# Altium schematic sheet MAIN.SchDoc
size A3; SheetNumber: 1; SheetTotal: 1
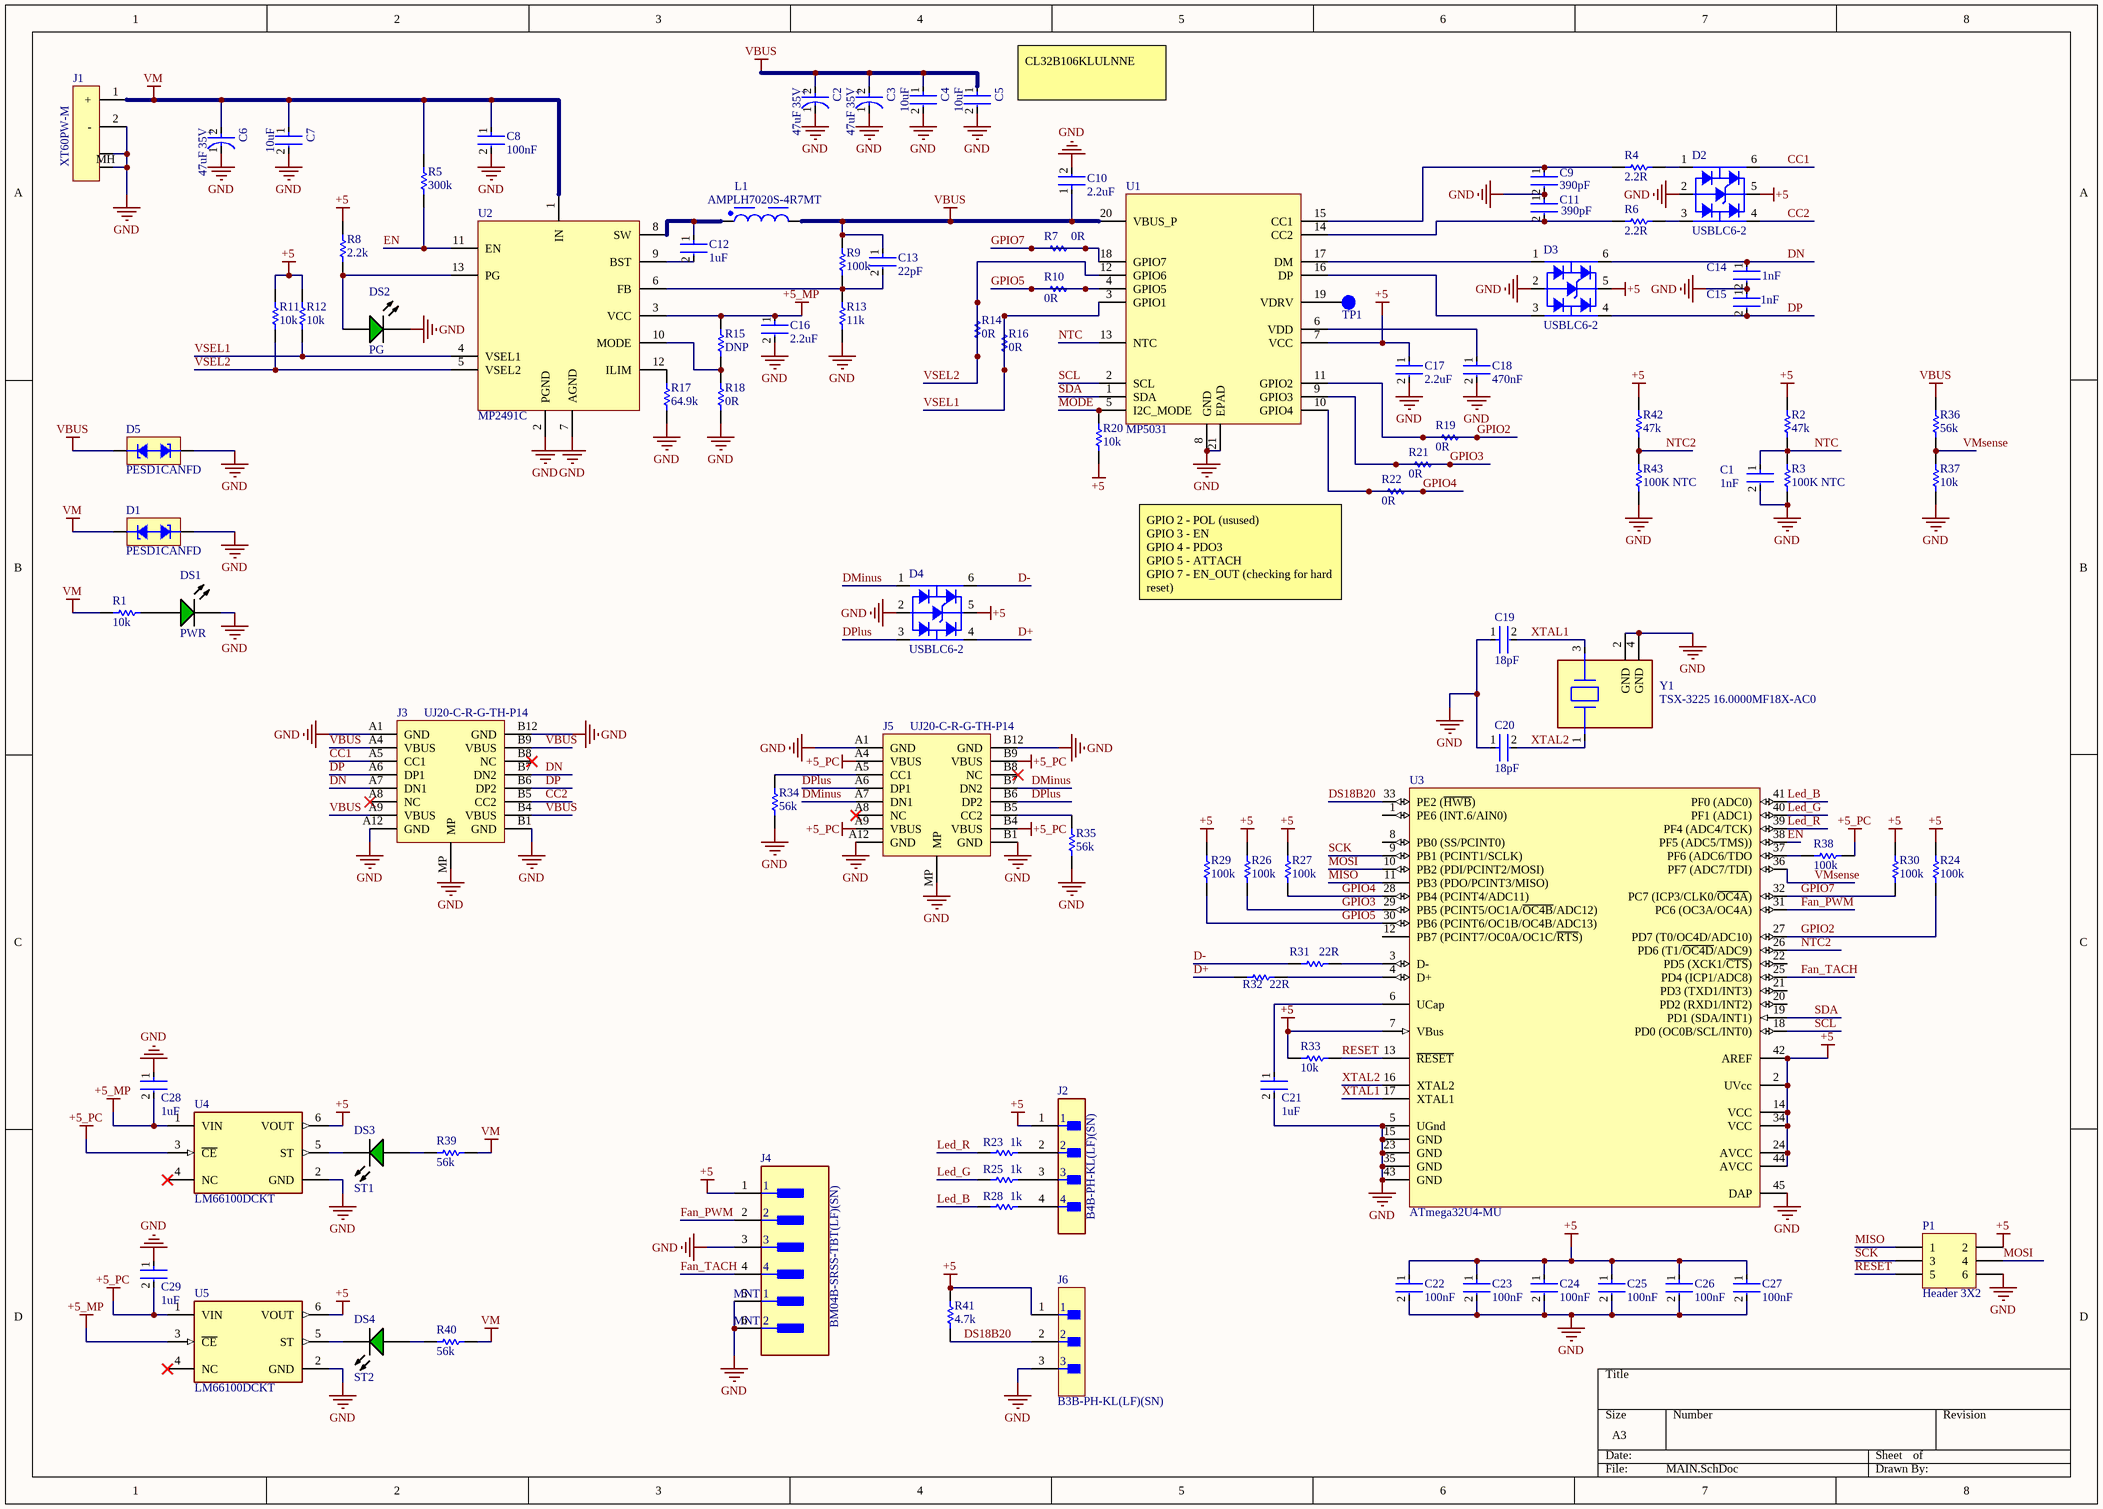
[diagram p0: MAIN.SchDoc]

## Parts
C1  1nF  [FP-0603-L_1_6_0_15-W_0_81-IPC_B]
C2  47uF 35V  [FP-T491X476K035AT-MFG]
C3  47uF 35V  [FP-T491X476K035AT-MFG]
C4  10uF  [FP-C1210C106M6PACTU-MFG]
C5  10uF  [FP-C1210C106M6PACTU-MFG]
C6  47uF 35V  [FP-T491X476K035AT-MFG]
C7  10uF  [FP-C1210C106M6PACTU-MFG]
C8  100nF  [FP-0603-L_1_6_0_1-W_0_8_0-IPC_C]
C9  390pF  [FP-C0603C-CF-IPC_B]
C10  2.2uF  [FP-GRM188-0_1-e0_2_0_5-IPC_B]
C11  390pF  [FP-C0603C-CF-IPC_B]
C12  1uF  [FP-0603-L_1_6_0_15-W_0_81-IPC_B]
C13  22pF  [FP-C0603C-CF-MFG]
C14  1nF  [FP-0603-L_1_6_0_15-W_0_81-IPC_B]
C15  1nF  [FP-0603-L_1_6_0_15-W_0_81-IPC_B]
C16  2.2uF  [FP-GRM188-0_1-e0_2_0_5-IPC_B]
C17  2.2uF  [FP-GRM188-0_1-e0_2_0_5-IPC_B]
C18  470nF  [FP-C0603C-CF-IPC_B]
C19  18pF  [FP-C0603C-CF-MFG]
C20  18pF  [FP-C0603C-CF-MFG]
C21  1uF  [FP-0603-L_1_6_0_15-W_0_81-MFG]
C22  100nF  [FP-0603-L_1_6_0_1-W_0_8_0-MFG]
C23  100nF  [FP-0603-L_1_6_0_1-W_0_8_0-MFG]
C24  100nF  [FP-0603-L_1_6_0_1-W_0_8_0-MFG]
C25  100nF  [FP-0603-L_1_6_0_1-W_0_8_0-MFG]
C26  100nF  [FP-0603-L_1_6_0_1-W_0_8_0-MFG]
C27  100nF  [FP-0603-L_1_6_0_1-W_0_8_0-MFG]
C28  1uF  [FP-0603-L_1_6_0_15-W_0_81-IPC_B]
C29  1uF  [FP-0603-L_1_6_0_15-W_0_81-IPC_B]
D1  PESD1CANFD  [DIOM1006X05N]
D2  USBLC6-2  [SOT95P280X145-6N]
D3  USBLC6-2  [SOT95P280X145-6N]
D4  USBLC6-2  [SOT95P280X145-6N]
D5  PESD1CANFD  [DIOM1006X05N]
DS1  PWR  [AVAG-HSMX-C170_V]
DS2  PG  [AVAG-HSMX-C170_V]
DS3  ST1  [AVAG-HSMX-C170_V]
DS4  ST2  [AVAG-HSMX-C170_V]
J1  XT60PW-M  [XT60PW-M]
J2  B4B-PH-KL(LF)(SN)  [FP-B4B-PH-KL_LF_SN-MFG]
J3  UJ20-C-R-G-TH-P14  [UJ20-C-R-G-TH-P14]
J4  BM04B-SRSS-TBT(LF)(SN)  [FP-BM04B-SRSS-TBT_LF_SN-MFG]
J5  UJ20-C-R-G-TH-P14  [UJ20-C-R-G-TH-P14]
J6  B3B-PH-KL(LF)(SN)  [FP-B3B-PH-KL_LF_SN-MFG]
L1  AMPLH7020S-4R7MT  [INDP7366X20N]
P1  Header 3X2  [HDR2X3]
R1  10k  [RESC1609X55X30NL15T15]
R2  47k  [RESC1608X55X30NL15T15]
R3  100K NTC  [RESC0603(1608)_N]
R4  2.2R  [RESC1609X50X30NL10T20]
R5  300k  [RESC1609X50X30NL10T20]
R6  2.2R  [RESC1609X50X30NL10T20]
R7  0R  [RESC1608X55X25NL10T15]
R8  2.2k  [RESC1608X50X30NL20T20]
R9  100k  [RESC1608X55X30LL15T15]
R10  0R  [RESC1608X55X25NL10T15]
R11  10k  [RESC1609X55X30NL15T15]
R12  10k  [RESC1609X55X30NL15T15]
R13  11k  [RESC1609X50X30LL10T20]
R14  0R  [RESC1608X55X25NL10T15]
R15  DNP  [RESC1608X55X25NL10T15]
R16  0R  [RESC1608X55X25NL10T15]
R17  64.9k  [RESC1608X55X30NL15T15]
R18  0R  [RESC1608X55X25NL10T15]
R19  0R  [RESC1608X55X25NL10T15]
R20  10k  [RESC1609X55X30NL15T15]
R21  0R  [RESC1608X55X25NL10T15]
R22  0R  [RESC1608X55X25NL10T15]
R23  1k  [RESC1608X55X25NL10T15]
R24  100k  [RESC1608X55X30NL15T15]
R25  1k  [RESC1608X55X25NL10T15]
R26  100k  [RESC1608X55X30NL15T15]
R27  100k  [RESC1608X55X30NL15T15]
R28  1k  [RESC1608X55X25NL10T15]
R29  100k  [RESC1608X55X30NL15T15]
R30  100k  [RESC1608X55X30NL15T15]
R31  22R  [RESC1608X55X30NL15T15]
R32  22R  [RESC1608X55X30NL15T15]
R33  10k  [RESC1609X55X30NL15T15]
R34  56k  [RESC0603(1608)_N]
R35  56k  [RESC0603(1608)_N]
R36  56k  [RESC0603(1608)_N]
R37  10k  [RESC1609X55X30NL15T15]
R38  100k  [RESC1608X55X30NL15T15]
R39  56k  [RESC0603(1608)_N]
R40  56k  [RESC0603(1608)_N]
R41  4.7k  [RESC1608X55X30NL15T15]
R42  47k  [RESC1608X55X30NL15T15]
R43  100K NTC  [RESC0603(1608)_N]
TP1  TESTPOINT  [TESTPOINT_0.6]  (value not drawn)
U1  MP5031  [QFN-20-MP5031]
U2  MP2491C  [QFN-13-MPS2491C]
U3  ATmega32U4-MU  [44PW_M]
U4  LM66100DCKT  [FP-DCK0006A-MFG]
U5  LM66100DCKT  [FP-DCK0006A-MFG]
Y1  TSX-3225 16.0000MF18X-AC0  [FP-TSX-3225-MFG]

## Nets
+5: C17.1 C22.1 C23.1 C24.1 C25.1 C26.1 C27.1 D2.5 D3.5 D4.5 J2.1 J4.1 J6.1 P1.2 R2.2 R8.2 R11.2 R12.2 R20.1 R24.2 R26.2 R27.2 R29.2 R30.2 R33.2 R41.2 R42.2 U1.7(VCC) U3.2(UVcc) U3.7(VBus) U3.14(VCC) U3.24(AVCC) U3.34(VCC) U3.42(AREF) U3.44(AVCC) U4.6(VOUT) U5.6(VOUT)
+5_MP: C16.1 C28.2 R15.2 U2.3(VCC) U4.1(VIN) U5.3(~{CE})
+5_PC: C29.2 J5.A4(VBUS) J5.A9(VBUS) J5.B4(VBUS) J5.B9(VBUS) R38.1 U4.3(~{CE}) U5.1(VIN)
GND: C1.2 C2.1(C) C3.1(C) C4.2 C5.2 C6.1(C) C7.2 C8.2 C9.2 C10.2 C11.1 C14.2 C15.1 C16.2 C17.2 C18.2 C19.1 C20.1 C21.2 C22.2 C23.2 C24.2 C25.2 C26.2 C27.2 C28.1 C29.1 D1.1 D2.2 D3.2 D4.2 D5.1 DS1.2(K) DS2.2(K) J1.2(-) J1.MH1 J1.MH2 J3.A1(GND) J3.A12(GND) J3.B1(GND) J3.B12(GND) J3.MP J4.3 J4.5(MNT_1) J4.6(MNT_2) J5.A1(GND) J5.A12(GND) J5.B1(GND) J5.B12(GND) J5.MP J6.3 P1.6 R3.1 R13.1 R17.1 R18.1 R34.1 R35.1 R37.1 R43.1 U1.8(GND) U1.21(EPAD) U2.2(PGND) U2.7(AGND) U3.5(UGnd) U3.15(GND) U3.23(GND) U3.35(GND) U3.43(GND) U3.45(DAP) U4.2(GND) U5.2(GND) Y1.2(GND) Y1.4(GND)
VBUS: C2.2(A) C3.2(A) C4.1 C5.1 C10.1 C13.1 D5.2 J3.A4(VBUS) J3.A9(VBUS) J3.B4(VBUS) J3.B9(VBUS) L1.2 R9.2 R36.2 U1.20(VBUS_P)
VM: C6.2(A) C7.1 C8.1 D1.2 J1.1(+) R1.2 R5.2 R39.1 R40.1 U2.1(IN)
CC1: D2.6 J3.A5(CC1)
CC2: D2.4 J3.B5(CC2)
D+: D4.4 R32.1
D-: D4.6 R31.1
DMinus: D4.1 J5.A7(DN1) J5.B7(DN2)
DN: C14.1 D3.6 J3.A7(DN1) J3.B7(DN2)
DP: C15.2 D3.4 J3.A6(DP1) J3.B6(DP2)
DPlus: D4.3 J5.A6(DP1) J5.B6(DP2)
DS18B20: J6.2 R41.1 U3.33(PE2_(~{HWB}))
EN: R5.1 U2.11(EN) U3.38(PF5_(ADC5/TMS)))
Fan_PWM: J4.2 U3.31(PC6_(OC3A/OC4A))
Fan_TACH: J4.4 U3.25(PD4_(ICP1/ADC8))
GPIO2: R19.1 R19.2 R24.1 U1.11(GPIO2) U3.27(PD7_(T0/OC4D/ADC10))
GPIO3: R21.1 R21.2 R26.1 U1.9(GPIO3) U3.29(PB5_(PCINT5/OC1A/~{OC4B}/ADC12))
GPIO4: R22.1 R22.2 R27.1 U1.10(GPIO4) U3.28(PB4_(PCINT4/ADC11))
GPIO5: R10.1 R10.2 R29.1 U1.4(GPIO5) U3.30(PB6_(PCINT6/OC1B/OC4B/ADC13))
GPIO7: R7.1 R7.2 R30.1 U1.18(GPIO7) U3.32(PC7_(ICP3/CLK0/~{OC4A}))
Led_B: R28.1 U3.41(PF0_(ADC0))
Led_G: R25.1 U3.40(PF1_(ADC1))
Led_R: R23.1 U3.39(PF4_(ADC4/TCK))
MISO: P1.1 U3.11(PB3_(PDO/PCINT3/MISO))
MODE: R20.2 U1.5(I2C_MODE)
MOSI: P1.4 U3.10(PB2_(PDI/PCINT2/MOSI))
NTC: C1.1 R2.1 R3.2 U1.13(NTC)
NTC2: R42.1 R43.2 U3.26(PD6_(T1/~{OC4D}/ADC9))
RESET: P1.5 R33.1 U3.13(~{RESET})
SCK: P1.3 U3.9(PB1_(PCINT1/SCLK))
SCL: U1.2(SCL) U3.18(PD0_(OC0B/SCL/INT0))
SDA: U1.1(SDA) U3.19(PD1_(SDA/INT1))
VMsense: R36.1 R37.2 U3.36(PF7_(ADC7/TDI))
VSEL1: R12.1 R16.1 R16.2 U1.3(GPIO1) U2.4(VSEL1)
VSEL2: R11.1 R14.1 R14.2 U1.12(GPIO6) U2.5(VSEL2)
XTAL1: C19.2 U3.17(XTAL1) Y1.3
XTAL2: C20.2 U3.16(XTAL2) Y1.1
NetC9_1: C9.1 R4.1 U1.15(CC1)
NetC11_2: C11.2 R6.1 U1.14(CC2)
NetC12_1: C12.1 L1.1 U2.8(SW)
NetC12_2: C12.2 U2.9(BST)
NetC13_2: C13.2 R9.1 R13.2 U2.6(FB)
NetC18_1: C18.1 U1.6(VDD)
NetC21_1: C21.1 U3.6(UCap)
NetD2_1: D2.1 R4.2
NetD2_3: D2.3 R6.2
NetD3_1: D3.1 U1.17(DM)
NetD3_3: D3.3 U1.16(DP)
NetDS1_1: DS1.1(A) R1.1
NetDS2_1: DS2.1(A) R8.1 U2.13(PG)
NetDS3_1: DS3.1(A) R39.2
NetDS3_2: DS3.2(K) U4.5(ST)
NetDS4_1: DS4.1(A) R40.2
NetDS4_2: DS4.2(K) U5.5(ST)
NetJ2_2: J2.2 R23.2
NetJ2_3: J2.3 R25.2
NetJ2_4: J2.4 R28.2
NetJ5_A5: J5.A5(CC1) R34.2
NetJ5_B5: J5.B5(CC2) R35.2
NetR15_1: R15.1 R18.2 U2.10(MODE)
NetR17_2: R17.2 U2.12(ILIM)
NetR31_2: R31.2 U3.3(D-)
NetR32_2: R32.2 U3.4(D+)
NetR38_2: R38.2 U3.37(PF6_(ADC6/TDO)
NetTP1_1: TP1.1 U1.19(VDRV)

Not connected (* = marked no-connect by the designer): J3 A8(NC)* B8(NC)*; J5 A8(NC)* B8(NC)*; U3 1(PE6_(INT.6/AIN0)) 8(PB0_(SS/PCINT0)) 12(PB7_(PCINT7/OC0A/OC1C/~{RTS})) 20(PD2_(RXD1/INT2)) 21(PD3_(TXD1/INT3)) 22(PD5_(XCK1/~{CTS})); U4 4(NC)*; U5 4(NC)*

## Notes on the sheet
- (near C5) CL32B106KLULNNE
- GPIO 2 - POL (usused)
  GPIO 3 - EN
  GPIO 4 - PDO3
  GPIO 5 - ATTACH
  GPIO 7 - EN_OUT (checking for hard reset)
- (in symbol CMP-03017-000044-1) +
- (in symbol XT60PW-M) MH

## Library data of the parts
C1 C14 C15 = CMP-2006-04378-2: General Purpose Ceramic Capacitor, 0603, 1nF, 10%, X7R, 15%, 50V; Case Code (Metric): 1608; Min Operating Temperature: -55°C; Weight: 7.1E-05oz; Series: -; Capacitance: 1nF; RoHS Compliant: Yes; Radiation Hardening: No; Height: 0.9mm; Mount: Surface Mount; REACH SVHC: No SVHC; Lead Free: Lead Free; Depth: 0.81mm; Voltage: 50V; Number of Pins: 2; Voltage Rating: 50V; Max Operating Temperature: 125°C; Termination: SMD/SMT; Construction: Flat; Case Code (Imperial): 0603; Dielectric: X7R; Width: 0.032inch; Tolerance: 10%; Case/Package: 0603; Contact Plating: Tin; Packaging: Tape and Reel; Voltage Rating (DC): 50V; Dielectric Material: Ceramic; Package Quantity: 4000; Thickness: 0.035inch; Length: 1.6mm
C2 C3 C6 = CMP-03017-000044-1: CAP TANT 47UF 10% 35V 2917; Ripple Current: 524mA; Polarity: Polar; Life (Hours): 2000Hour; Dissipation Factor: 8%; Leakage Current: 16.5uA; ESR (Equivalent Series Resistance): 600mR; Dielectric Material: Tantalum; Termination: SMD/SMT; Tolerance: 10%; Case Code (Metric): 7343; Radiation Hardening: No; Height: 4mm; Width: 4.3mm; Lead Free: Lead Free; Package Quantity: 1; Case Code (Imperial): 2917; Voltage Rating: 35V; Number of Pins: 2; Max Operating Temperature: 125°C; RoHS Compliant: Yes; Length: 7.3mm; Construction: Flat; Voltage Rating (DC): 35V; Capacitance: 47uF; Features: General Purpose; Voltage: 35V; REACH SVHC: No SVHC; Mount: Surface Mount; Series: T491; Case/Package: 2917; Height - Seated (Max): 0.169inch; Depth: 4.3mm; Packaging: Tape and Reel; Min Operating Temperature: -55°C
C4 C5 C7 = CMP-1038-02235-2: CAP CER 10UF 35V X5R 1210; Dissipation Factor: 2.5%; Tolerance: 20%; Dielectric Material: Ceramic; Voltage: 35V; Package Quantity: 2000; Series: C; Case Code (Metric): 3225; Length: 3.2mm; Dielectric: X5R; Height: 1.9mm; Max Operating Temperature: 85°C; Termination: SMD/SMT; Case/Package: 1210; Min Operating Temperature: -55°C; Depth: 2.5mm; Packaging: Tape and Reel; Case Code (Imperial): 1210; Width: 2.5mm; Radiation Hardening: No; Voltage Rating: 35V; Mount: Surface Mount; Voltage Rating (DC): 35V; Capacitance: 10uF; Thickness: 0.083inch; Construction: Flat; REACH SVHC: No SVHC
C8 C22-C27 = CMP-14477-000532-2: None; Dielectric: X5R; Voltage Rating: 50V; Tolerance: 10%; Thickness: 0.035inch; Lead Free: Lead Free; Case/Package: 0603; Min Operating Temperature: -55°C; RoHS Compliant: Yes; Mount: Surface Mount; Width: 0.031inch; Max Operating Temperature: 85°C; Height: 0.8mm; Case Code (Imperial): 0603; Capacitance: 100nF; Case Code (Metric): 1608; Package Quantity: 4000; Packaging: Tape and Reel; Voltage Rating (DC): 50V; Halogen Free: Halogen Free; Termination: SMD/SMT; Length: 0.063inch; Ratings: AEC-Q200
C9 C11 = CMP-2006-03190-2: CAP CER 390PF 50V C0G/NP0 0603; Manufacturer: KEMET; Manufacturer Part Number: C0603C391J5GACTU; Temperature Coefficient: 30ppm/°C; Tolerance: 0.05; Automotive Grade: Grade 1; Material: Ceramic; Temperature Characteristic: C0G; Temperature Range Low: -55°C; Automotive: Yes; Package: C0603C-CF; Category: Cap; Mouser Description: Multilayer Ceramic Capacitors MLCC - SMD/SMT 50volts 390pF C0G 5%; Temperature: -55°C to +125°C; Device Class L3: Ceramic Capacitors; Device Class L1: Passive Components; Temperature Range High: +125°C; Capacitance: 390 pF; Digikey Description: CAP CER 390PF 50V C0G/NP0 0603; RoHS: TRUE; Octopart: https://octopart.com/c0603c391j5gactu-kemet-103230; Lead Free: Yes; Device Class L2: Capacitors; Height: 0.87mm; ComponentLink2URL: https://api.kemet.com/component-edge/download/datasheet/C0603C100J5GACAUTO.pdf; Value: 390 pF; Voltage Rating: 50 V; ComponentLink2Description: Datasheet
C10 C16 C17 = CMP-2006-02836-2: Chip Multilayer Ceramic Capacitors for General Purpose, 0603, 2.2uF, X7R, 15%, 10%, 10V; Case Code (Metric): 1608; Height: 0.8mm; Packaging: Cut Tape; Voltage: 10V; Lead Free: Lead Free; Min Operating Temperature: -55°C; Voltage Rating (DC): 10V; Max Operating Temperature: 125°C; Voltage Rating: 10V; Dielectric: X7R; Depth: 0.8mm; Case Code (Imperial): 0603; Termination: SMD/SMT; Case/Package: 0603; Number of Pins: 2; REACH SVHC: No SVHC; Mount: Surface Mount; Width: 0.031inch; Material: Ceramic; Capacitance: 2.2uF; Package Quantity: 1; Weight: 7.1E-05oz; Length: 1.6mm; Thickness: 0.035inch; Tolerance: 10%
C12 C21 C28 C29 = CMP-2006-04532-2: General Purpose Ceramic Capacitor, 0603, 1uF, 10%, X5R, 15%, 16V; Dissipation Factor: 12.5%; Insulation Resistance: 10GR; Case/Package: 0603; Depth: 0.81mm; Max Operating Temperature: 85°C; Number of Pins: 2; Thickness: 0.035inch; Packaging: Tape and Reel; RoHS Compliant: Yes; Construction: Flat; Mount: Surface Mount; Width: 0.81mm; Case Code (Metric): 1608; Voltage Rating (DC): 16V; Voltage: 16V; Height: 0.9mm; Capacitance: 1uF; Length: 1.6mm; Dielectric: X5R; Voltage Rating: 16V; Radiation Hardening: No; Series: -; Case Code (Imperial): 0603; Tolerance: 10%; Lead Free: Lead Free; Termination: SMD/SMT; Min Operating Temperature: -55°C; Package Quantity: 1; REACH SVHC: No SVHC
C13 = CMP-2006-03119-3: Cap Ceramic 22pF 50V C0G 5% SMD 0603 125°C Paper T/R; Manufacturer Part Number: C0603C220J5GACTU; Manufacturer: KEMET; Temperature Coefficient: 30ppm/°C; Automotive Grade: Grade 1; Tolerance: 0.05; RoHS: TRUE; Temperature Characteristic: C0G; Capacitance: 22 pF; Device Class L3: Ceramic Capacitors; Digikey Description: Cap Ceramic 22pF 50V C0G 5% SMD 0603 125°C Paper T/R; ComponentLink2URL: https://api.kemet.com/component-edge/download/datasheet/C0603C100J5GACAUTO.pdf; ComponentLink2Description: Datasheet; Automotive: Yes; Temperature: -55°C to +125°C; Temperature Range High: +125°C; Package: C0603C-CF; Device Class L1: Passive Components; Device Class L2: Capacitors; Lead Free: Yes; Value: 22 pF; Category: Cap; Mouser Description: Cap Ceramic 22pF 50V C0G 5% SMD 0603 125°C Paper T/R; Voltage Rating: 50 V; Height: 0.87mm; Material: Ceramic; Temperature Range Low: -55°C; Octopart: https://octopart.com/c0603c220j5gactu-kemet-98525
C18 = CMP-2006-03235-2: CAP CER 0.47UF 16V X7R 0603; Manufacturer Part Number: C0603C474K4RACTU; Manufacturer: KEMET; Automotive Grade: Grade 1; Value: 0.47 μF; Tolerance: 0.1; Temperature Coefficient: 30ppm/°C; Material: Ceramic; Device Class L3: Ceramic Capacitors; ComponentLink2URL: https://api.kemet.com/component-edge/download/datasheet/C0603C100J5GACAUTO.pdf; Height: 0.87mm; ComponentLink2Description: Datasheet; Device Class L2: Capacitors; Temperature Range Low: -55°C; Temperature Range High: +125°C; RoHS: TRUE; Mouser Description: 0603 C 470nF Ceramic Multilayer Capacitor, 16 V, +125degC, X7R Dielec, +/-10%; Temperature Characteristic: X7R; Digikey Description: CAP CER 0.47UF 16V X7R 0603; Lead Free: Yes; Automotive: Yes; Octopart: https://octopart.com/c0603c474k4ractu-kemet-109683; Capacitance: 0.47 μF; Package: C0603C-CF; Voltage Rating: 16 V; Device Class L1: Passive Components; Category: Cap; Temperature: -55°C to +125°C
C19 C20 = CMP-03020-027993-1: C0603 18 pF X8R 30ppm/°C 10.00% 16 V; Manufacturer Part Number: C0603C180K4HACTU; Manufacturer: KEMET; Voltage Rating: 16 V; Material: Ceramic; Tolerance: 0.1; Automotive Grade: Grade 1; ComponentLink2URL: https://api.kemet.com/component-edge/download/datasheet/C0603C100J5GACAUTO.pdf; Package: C0603C-CF; Temperature Range Low: -55°C; Temperature Characteristic: X8R; Capacitance: 18 pF; Temperature Coefficient: 30ppm/°C; Lead Free: Yes; ComponentLink2Description: Datasheet; Automotive: Yes; Octopart: https://octopart.com/c0603c180k4hactu-kemet-88725221; Height: 0.87mm; Temperature: -55°C to +125°C; Temperature Range High: +125°C; Device Class L1: Passive Components; Device Class L3: Ceramic Capacitors; Category: Cap; RoHS: TRUE; Value: 18 pF; Device Class L2: Capacitors
D1 D5 = PESD1CANFD: Extremely low clamping bidirectional ESD protection diode
D2-D4 = USBLC6-2: Very low capacitance ESD protection
DS1-DS4 = CMP-2000-05062-1: Chip LED, Green, 2.2 V, -40 to 85 degC, 2-Pin SMD, Pb-Free, Tape and Reel; Manufacturer: Avago; No. of Pins: 2; Peak Wavelength: 570nm; SVHC: NoSVHC(16-Jun-2014); Dominant Wavelength: 572nm; Forward Current If: 20mA; Viewing Angle: 170deg; Lens Shape: Rectangular; PIV Max: 5V; External Width: 1.25mm; LED Type: Standard; External Depth: 0.8mm; Opto Mounting Orientation: Top; Luminous Intensity: 15mcd; Luminous Intensity Min: 4mcd; Forward Voltage VF Max: 2.6V; External Length / Height: 2mm; Bulb Size: 1.25mmx1.4mm; Light Area Height: 1mm; Voltage Vf Typ: 2.2V; Operating Temperature Max: 85degC; Datasheet Version: Oct-08; MSL: MSL2A-4weeks; Peak Forward Current: 20mA; Package Description: 2-Pin Surface Mount Device, Body 2 x 1.25 mm, Height 0.8 mm; Datasheet URL: https://datasheet.ciiva.com/29280/180495-da-01-en-chip-led-hsmg-c170-gelb-gruen-29280971.pdf; Storage Temperature Min: -40degC; LED Colour: Green; Wavelength Typ: 570nm; Mounting Type: SMD; Forward Current If Max: 20mA; Dominant Wavelength Typ: 572nm; LED Mounting: SMD; Operating Temperature Range: -30degCto+85degC; Operating Temperature Min: -30degC; Manufacturer URL: http://www.avagotech.com/; Packaging: CutTape; Luminous Intensity Typ: 15mcd; Package Reference: HSMX-C170; Storage Temperature Max: 85degC; Opto Case Style: SMD; Forward Voltage: 2.2V
J1 = XT60PW-M: Connector: DC supply; socket; XT60; male; PIN: 2; on PCBs; THT; 30A
J2 = CMP-17439-000575-1: CONN HEADER VERT 4POS 2MM; Number of Positions: 4; Voltage Rating: 100V; Insulation Material: Nylon; Series: PH; Min Operating Temperature: -25°C; Contact Finish - Mating: TIN; Pitch: 2mm; Number of Rows: 1; Contact Material: Copper Alloy; Contact Shape: Square; Connector Type: Header; Flammability Rating: UL94 V-0; Insulation Color: Grey; Fastening Type: Detent; Contact Type: Male Pin; Termination: Press-Fit; Mount: Through Hole; Packaging: Bulk; Max Operating Temperature: 85°C; Lead Free: Lead Free
J3 J5 = USB C
J4 = CMP-17439-000370-1: CONN HEADER SMD 4POS 1MM; Voltage Rating: 50V; Number of Positions: 4; Pitch: 0.039inch; Mated Stacking Heights: 4.9mm; Packaging: Cut Tape; Contact Material: Copper Alloy; Lead Free: Lead Free; Contact Type: Male Pin; Fastening Type: Pull; Connector Type: Header; Contact Finish - Mating: TIN; Series: SR; Number of Rows: 1; Contact Shape: Square; Package Quantity: 1; Color: Natural; Flammability Rating: UL94 V-0; Mount: Surface Mount; Insulation Color: Natural; Termination: Solder; Contact Plating: Tin; Insulation Material: Nylon
J6 = CMP-00504-18683939-1: B3B-PH-KL(LF)(SN) Connector Header, 3 Position, Top entry, 2.0mm Pitch, 100V, 32-24 AWG, Tin Plated; Gender: Male; Pitch: 2mm; Contact Resistance: 20mΩ; Max Current Rating: 2A; Number of Contacts: 3; Orientation: Straight; Max Operating Temperature: 85°C; Depth: 4.5mm; Number of Rows: 1; Contact Plating: Copper, Tin; Packaging: Box; Height: 6mm; RoHS: Compliant; Voltage Rating: 100V; Number of Pins: 3; Housing Color: Yellow; Current Rating: 2A; Housing Material: Polyamide; Termination: Solder; Max Voltage Rating (AC): 100V; Lead Free: Lead Free; Length: 7.9mm; NexarPartId: 18683939; Min Operating Temperature: -25°C; Contact Material: Copper, Tin
L1 = AMPLH7020S-4R7MT: FIXED IND 4.7UH 5.5A 45.6MOHM SM
P1 = Header 3X2: Header, 3-Pin, Dual row; LatestRevisionDate: 17-Jul-2002; LatestRevisionNote: Re-released for DXP Platform.; Publisher: Altium Limited
R1 R11 R12 R20 R33 R37 = CMP-1012-00623-3: Chip Resistor, 10 KOhm, +/- 1%, 0.1 W, -55 to 155 degC, 0603 (1608 Metric), RoHS, Tape and Reel; Manufacturer: Panasonic; Voltage Rating: 75V; Case\/Package: 0603; Power Rating: 100mW; Resistance: 10KOhm; Temperature Coefficient: 100ppm\/degreesC; Number of Pins: 2; Package Reference: 603; Depth: 0.8mm; Mount: SurfaceMount; Package Description: 2-Pin Surface Mount Device, Body 1.6 x 0.85 mm; Datasheet Version: 02/2017; Length: 1.6mm; Lead Free: LeadFree; Height: 0.45mm; Number of Terminations: 2; Max Power Dissipation: 100mW; Min Operating Temperature: -55degC; Datasheet URL: https://industrial.panasonic.com/cdbs/www-data/pdf/RDA0000/AOA0000C304.pdf; Termination: SMD/SMT; Case Code (Metric): 1608; Case Code (Imperial): 0603; Tolerance: 1%; Max Operating Temperature: 155degC; RoHSCompliant: true; Voltage Rating (DC): 75V; Radiation Hardening: No; Packaging: TapeandReel; Composition: ThickFilm; Mounting Technology: SurfaceMount; Manufacturer URL: http://www.panasonic.com/; Width: 0.031inch; REACH SVHC: NoSVHC; Contact Plating: Tin; Military Standard: Not; Package Quantity: 1
R2 R42 = CMP-2000-00523-2: Chip Resistor, 47 KOhm, +/- 1%, 0.1 W, -55 to 155 degC, 0603 (1608 Metric), RoHS, Tape and Reel; Case\Package: 0603; Forward Current: 20 mA; Power Rating: 90 mW; Illumination Colour: Red; Nominal Vf: 2.1 V; Viewing Angle: 160 degrees; Luminous Intensity: 63 mcd; Lens Style: Clear; Nominal Wavelength: 639 nm; Case Code (Imperial): 0603; Case Code (Metric): 1608; Packaging: Tape and Reel; Radiation Hardening: No; Colour: Red; PackageDescription: 2-Pin Surface Mount Device, Body 1.6 x 0.85 mm; ComponentLink1Description: Manufacturer URL; Width: 0.8 mm; DatasheetVersion: Apr-15; ComponentLink2URL: http://industrial.panasonic.com/cdbs/www-data/pdf/RDA0000/AOA0000C86.pdf; Min Operating Temperature: -40 degC; Height: 0.6 mm; Package Quantity: 3000; ComponentLink2Description: Datasheet; REACH SVHC: No SVHC; ComponentLink1URL: http://www.panasonic.com/; Mount: Surface Mount; RoHSCompliant: true; Max Operating Temperature: 100 degC; PackageReference: 0603; Length: 1.6 mm; Forward Voltage: 2.1 V; Pins: 2
R3 R43 = CMP-1012-00122-1: 100K 0.1W 5% 0603 (1608 Metric)  SMD; Case-EIA: 0603; Value: 100000.00 Ohm; Case-Metric: 1608; Tolerance: 5 %; Power: 0.1 W; Technology: SMT
R4 R6 = CMP-2000-03206-1: Manufacturer: Vishay Dale; Part Number: CRCW06032R20FKEA
R5 = CMP-2000-03214-1: Manufacturer: Vishay Dale; Part Number: CRCW0603300KFKEA
R7 R10 R14-R16 R18 R19 R21 R22 = CMP-2100-03667-1: Chip Resistor, 0 Ohm, +/- 5%, 0.1 W, -55 to 155 degC, 0603 (1608 Metric), RoHS, Tape and Reel; Manufacturer: Yageo; Temperature Coefficient: 200ppm/degreesC; Voltage Rating: 50V; Power Rating: 100mW; Resistance: 0mOhm; Width: 0.8mm; Max Operating Temperature: 155degC; Tolerance: 5%; Package Reference: 0603; Height: 0.45mm; Depth: 0.8mm; Package Description: 2-Pin Surface Mount Device, Body 1.6 x 0.8 mm; Termination: SMD/SMT; Package Quantity: 5000; Case/Package: 0603; Case Code (Imperial): 0603; Radiation Hardening: No; Number of Pins: 2; Length: 1.6mm; Lead Free: LeadFree; Voltage Rating (DC): 50V; Military Standard: Not; Datasheet URL: http://www.yageo.com/NewPortal/yageodocoutput?fileName=/pdf/R-Chip/PYu-RC_Group_51_RoHS_L_5.pdf; Manufacturer URL: http://www.yageo.com/; Packaging: TapeandReel; Case Code (Metric): 1608; Min Operating Temperature: -55degC; Composition: ThickFilm; RoHSCompliant: true; Contact Plating: Tin; Datasheet Version: Rev. 5, 10/2016; REACH SVHC: NoSVHC
R8 = CMP-2000-02545-1: Part Number: RR0816P-223-B-T5; Manufacturer: Susumu
R9 R24 R26 R27 R29 R30 R38 = CMP-2000-00182-1: Part Number: ERJ-3EKF1003V; Manufacturer: Panasonic
R13 = CMP-2000-03860-1: Part Number: CRCW060311K0FKEA; Manufacturer: Vishay Dale
R17 = CMP-2000-00605-1: Part Number: ERJ-3EKF6492V; Manufacturer: Panasonic
R23 R25 R28 = CMP-2000-04525-1: Part Number: RT0603BRE071KL; Manufacturer: Yageo
R31 R32 = CMP-1012-00320-3: Chip Resistor, 22 Ohm, +/- 1%, 0.1 W, -55 to 155 degC, 0603 (1608 Metric), RoHS, Tape and Reel; PackageReference: 0603; ComponentLink2URL: http://industrial.panasonic.com/cdbs/www-data/pdf/RDA0000/AOA0000C86.pdf; ComponentLink2Description: Datasheet; PackageDescription: 2-Pin Surface Mount Device, Body 1.6 x 0.85 mm; ComponentLink1URL: http://www.panasonic.com/; ComponentLink1Description: Manufacturer URL; DatasheetVersion: Apr-15
R34-R36 R39 R40 = CMP-1012-00116-1: 56K 0.1W 5% 0603 (1608 Metric)  SMD; Case-Metric: 1608; Value: 56000.00 Ohm; Case-EIA: 0603; Technology: SMT; Tolerance: 5 %; Power: 0.1 W
R41 = CMP-1012-00586-3: Precision Thick Film Chip Resistor, 4.7 KOhm, +/- 1%, -55 to 155 degC, 0603 (1608 Metric), RoHS, Tape and Reel; Resistance: 220 Ohm; Voltage Rating: 50 V; Elements: 4; Case\Package: 1205; Tolerance: 5%; Power Rating: 250 mW; PackageReference: 0603; Max Operating Temperature: 125 degC; REACH SVHC: No SVHC; Width: 0.063 inch; Length: 0.126 inch; Height: 0.024 inch; Mount: Surface Mount; Package Quantity: 1; DatasheetVersion: Apr-15; ComponentLink1Description: Manufacturer URL; Min Operating Temperature: -55 degC; Packaging: Tape and Reel; Radiation Hardening: No; ComponentLink2URL: http://industrial.panasonic.com/cdbs/www-data/pdf/RDA0000/AOA0000C86.pdf; Case Code (Metric): 3216; Pins: 8; Case Code (Imperial): 1206; Type (Resistor): Thick Film; RoHSCompliant: true; ComponentLink2Description: Datasheet; PackageDescription: 2-Pin Surface Mount Device, Body 1.6 x 0.85 mm; ComponentLink1URL: http://www.panasonic.com/
U3 = CMP-0095-00166-2: 8-bit AVR Microcontroller, 2.7-5.5V, 16MHz, 32KB Flash, 1KB EEPROM, 2.5KB SRAM, USB Controller, 44-pin QFN, Industrial Grade (-40°C to 85°C), Ext Osc; PackageVersion: revG, Sep-2009; PackageReference: 44PW; ComponentLink1URL: http://www.atmel.com/; PackageDescription: 44-Pin Quad Flat No-Lead Package, 7 x 7 mm Body, 0.5 mm Pitch (QFN); ComponentLink3Description: ATmega16U4 ATmega32U4 Summary; RevisionNote: DatasheetVersion, PackageVersion & PCB updated. URLs added.; ComponentLink2Description: ATmega16U4/32U4 Datasheet; ComponentLink1Description: Manufacturer URL; ComponentLink3URL: http://www.atmel.com/dyn/resources/prod_documents/7766S.pdf; DatasheetVersion: revF, Nov-2010; ComponentLink2URL: http://www.atmel.com/dyn/resources/prod_documents/doc7766.pdf; Code_JEDEC: MO-220-VKKD-1
U4 U5 = CMP-04910-000059-1: IC OR CTRLR IDEAL DIODE SC70-6
Y1 = CMP-36405-000005-1: CRYSTAL 16.00 MHZ 9PF SMD; Manufacturer: EPSON; Stability: 18ppm; Esr: 60Ω; Frequency: 16MHz; Tolerance: 10ppm; Series: TSX-3225; Manufacturer Part Number: TSX-3225 16.0000MF18X-AC0; Temperature Range High: +85°C; ComponentLink2URL: https://support.epson.biz/td/api/doc_check.php?dl=brief_TSX-3225&lang=en; Temperature Range Low: -40°C; RoHS: TRUE; Lead Free: Yes; Mouser Description: CRYSTAL 16.00 MHZ 9PF SMD; Category: Crys; Temperature: -40°C to +85°C; Device Class L1: Passive Components; Height: 0.6mm; Octopart: https://octopart.com/tsx-3225+16.0000mf18x-ac0-epson-58756552; Automotive: No; Digikey Description: CRYSTAL 16.00 MHZ 9PF SMD; ComponentLink2Description: Datasheet; Load Capacitance: 9pF; Package: TSX-3225; Device Class L3: Crystals; Device Class L2: Crystals / Oscillators